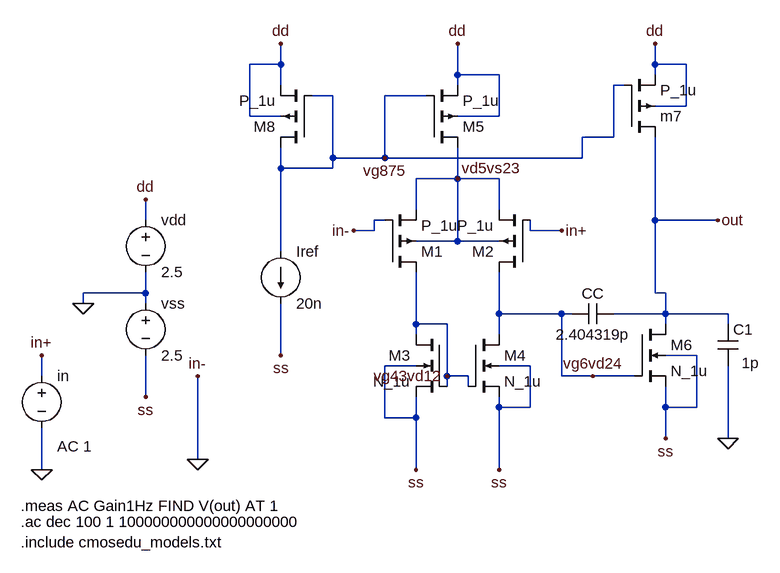
[diagram p0: schematic part5.asc]
part5.asc, the LTspice schematic file:
Version 4
SHEET 1 880 680
WIRE -272 -288 -272 -320
WIRE -272 -288 -320 -288
WIRE 304 -288 304 -320
WIRE 352 -288 304 -288
WIRE 0 -272 0 -320
WIRE 64 -272 0 -272
WIRE 304 -272 304 -288
WIRE -272 -256 -272 -288
WIRE 0 -256 0 -272
WIRE 256 -256 240 -256
WIRE -192 -240 -224 -240
WIRE -48 -240 -112 -240
WIRE 352 -224 352 -288
WIRE 352 -224 304 -224
WIRE -320 -208 -320 -288
WIRE -272 -208 -320 -208
WIRE 64 -208 64 -272
WIRE 64 -208 0 -208
WIRE 240 -176 240 -256
WIRE 240 -176 192 -176
WIRE -192 -144 -192 -240
WIRE -112 -144 -112 -240
WIRE -112 -144 -192 -144
WIRE 192 -144 192 -176
WIRE 192 -144 -112 -144
WIRE -272 -128 -272 -160
WIRE -192 -128 -192 -144
WIRE -192 -128 -272 -128
WIRE 0 -112 0 -160
WIRE 0 -112 -64 -112
WIRE 64 -112 0 -112
WIRE -64 -64 -64 -112
WIRE 64 -64 64 -112
WIRE -480 -48 -480 -80
WIRE -112 -48 -128 -48
WIRE 304 -48 304 -176
WIRE 400 -48 304 -48
WIRE -128 -32 -128 -48
WIRE -128 -32 -160 -32
WIRE 112 -32 112 -48
WIRE 160 -32 112 -32
WIRE 0 -16 0 -112
WIRE 0 -16 -64 -16
WIRE 64 -16 0 -16
WIRE -272 0 -272 -128
WIRE -480 64 -480 32
WIRE -480 64 -576 64
WIRE 304 64 304 -48
WIRE 320 64 304 64
WIRE -576 80 -576 64
WIRE -480 80 -480 64
WIRE 64 96 64 32
WIRE 160 96 64 96
WIRE 176 96 160 96
WIRE 320 96 320 64
WIRE 320 96 240 96
WIRE 416 96 320 96
WIRE -64 112 -64 32
WIRE -16 112 -64 112
WIRE 320 112 320 96
WIRE 416 112 416 96
WIRE -64 128 -64 112
WIRE 64 128 64 96
WIRE -272 160 -272 80
WIRE 368 160 320 160
WIRE -64 176 -112 176
WIRE 112 176 64 176
WIRE -640 192 -640 160
WIRE -16 192 -16 112
WIRE 16 192 -16 192
WIRE 160 192 160 96
WIRE 208 192 160 192
WIRE 272 192 208 192
WIRE -16 208 -16 192
WIRE 16 208 16 192
WIRE -480 224 -480 160
WIRE 64 240 64 224
WIRE 112 240 112 176
WIRE 112 240 64 240
WIRE 320 240 320 208
WIRE 368 240 368 160
WIRE 368 240 320 240
WIRE -112 256 -112 176
WIRE -64 256 -64 224
WIRE -64 256 -112 256
WIRE 320 288 320 240
WIRE 416 288 416 176
WIRE -400 320 -400 192
WIRE -640 336 -640 272
WIRE -64 336 -64 256
WIRE 64 336 64 240
FLAG -480 -80 dd
FLAG -272 -320 dd
FLAG 0 -320 dd
FLAG 304 -320 dd
FLAG -160 -32 in-
FLAG 160 -32 in+
FLAG 400 -48 out
FLAG -64 336 ss
FLAG 64 336 ss
FLAG 320 288 ss
FLAG -272 160 ss
FLAG -480 224 ss
FLAG -400 320 0
FLAG -400 192 in-
FLAG -640 336 0
FLAG -576 80 0
FLAG -640 160 in+
FLAG 416 288 0
FLAG -112 -144 vg875
FLAG 0 -112 vd5vs23
FLAG -16 192 vg43vd12
FLAG 208 192 vg6vd24
SYMBOL voltage -480 -64 R0
WINDOW 123 0 0 Left 2
WINDOW 39 0 0 Left 2
SYMATTR InstName vdd
SYMATTR Value 2.5
SYMBOL pmos4 -224 -160 R180
SYMATTR InstName M8
SYMATTR Value P_1u
SYMATTR Value2 l=2.196550u w=28.262059u
SYMBOL pmos4 -48 -160 M180
SYMATTR InstName M5
SYMATTR Value P_1u
SYMATTR Value2 l=2.196550u w=28.262059u
SYMBOL pmos4 256 -176 M180
SYMATTR InstName m7
SYMATTR Value P_1u
SYMATTR Value2 l=2.196550u w=28.262059u
SYMBOL pmos4 -112 32 M180
SYMATTR InstName M1
SYMATTR Value P_1u
SYMATTR Value2 l=33.582018u w=38.700065u
SYMBOL pmos4 112 32 R180
SYMATTR InstName M2
SYMATTR Value P_1u
SYMATTR Value2 l=33.582018u w=38.700065u
SYMBOL nmos4 -16 128 M0
SYMATTR InstName M3
SYMATTR Value N_1u
SYMATTR Value2 l=13.003862u w=19.350264u
SYMBOL nmos4 16 128 R0
SYMATTR InstName M4
SYMATTR Value N_1u
SYMATTR Value2 l=13.003862u w=19.350264u
SYMBOL current -272 0 R0
WINDOW 123 0 0 Left 2
WINDOW 39 0 0 Left 2
SYMATTR InstName Iref
SYMATTR Value 20n
SYMBOL nmos4 272 112 R0
SYMATTR InstName M6
SYMATTR Value N_1u
SYMATTR Value2 l=16.810376u w=50.000000u
SYMBOL cap 240 80 R90
WINDOW 0 0 32 VBottom 2
WINDOW 3 32 32 VTop 2
SYMATTR InstName CC
SYMATTR Value 2.404319p
SYMBOL voltage -480 64 R0
WINDOW 123 0 0 Left 2
WINDOW 39 0 0 Left 2
SYMATTR InstName vss
SYMATTR Value 2.5
SYMBOL voltage -640 176 R0
WINDOW 123 24 124 Left 2
WINDOW 39 0 0 Left 2
SYMATTR Value2 AC 1
SYMATTR InstName in
SYMATTR Value ""
SYMBOL cap 400 112 R0
WINDOW 3 37 60 Left 2
SYMATTR Value 1p
SYMATTR InstName C1
TEXT -672 416 Left 2 !.ac dec 100 1 100000000000000000000
TEXT -672 448 Left 2 !.include cmosedu_models.txt
TEXT -672 392 Left 2 !.meas AC Gain1Hz FIND V(out) AT 1

The netlist it stands for:
* part5.asc
vdd dd 0 2.5
M8 vg875 vg875 dd dd P_1u l=2.196550u w=28.262059u
M5 vd5vs23 vg875 dd dd P_1u l=2.196550u w=28.262059u
m7 out vg875 dd dd P_1u l=2.196550u w=28.262059u
M1 vg43vd12 0 vd5vs23 vd5vs23 P_1u l=33.582018u w=38.700065u
M2 vg6vd24 in+ vd5vs23 vd5vs23 P_1u l=33.582018u w=38.700065u
M3 vg43vd12 vg43vd12 ss ss N_1u l=13.003862u w=19.350264u
M4 vg6vd24 vg43vd12 ss ss N_1u l=13.003862u w=19.350264u
Iref vg875 ss 20n
M6 out vg6vd24 ss ss N_1u l=16.810376u w=50.000000u
CC out vg6vd24 2.404319p
vss 0 ss 2.5
V§in in+ 0 AC 1
C1 out 0 1p
.model NMOS NMOS
.model PMOS PMOS
.lib standard.mos
.ac dec 100 1 100000000000000000000
.include cmosedu_models.txt
.meas AC Gain1Hz FIND V(out) AT 1
.backanno
.end